# Altium project DigitalTransportAnalyser.PrjPcb
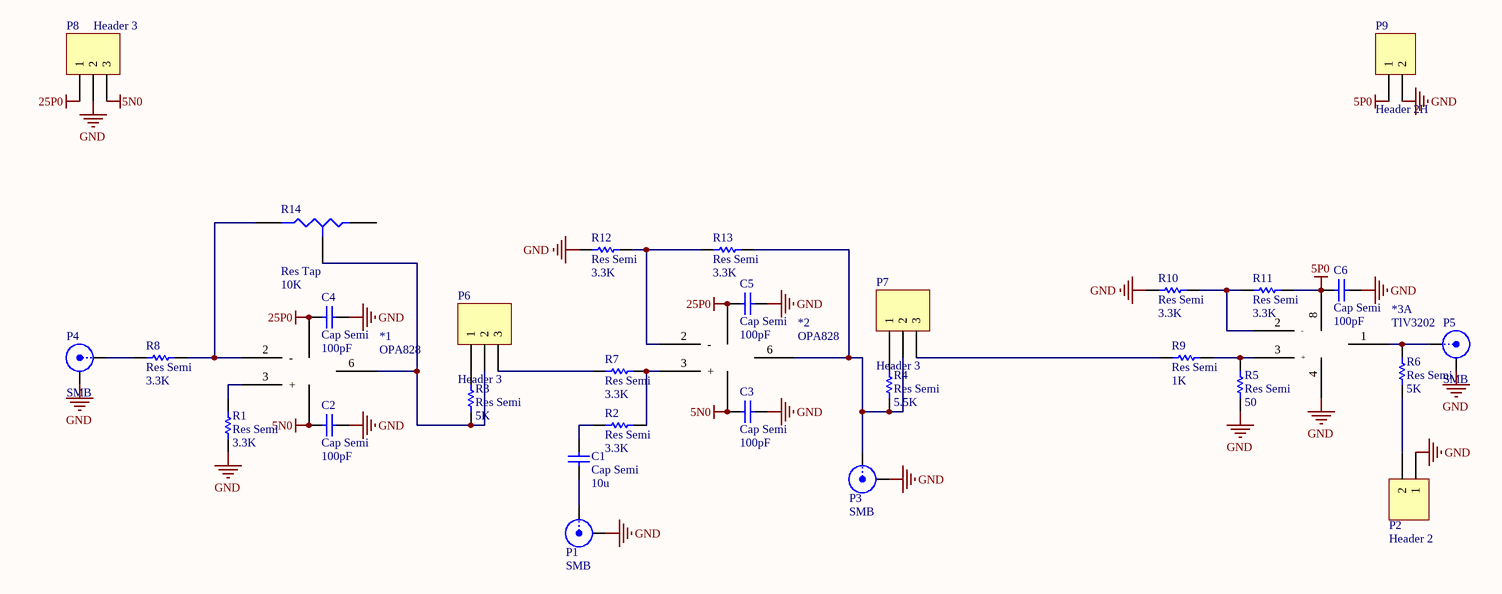
[diagram p0: Gain&Adder.SchDoc]
1 sheet, 32 parts. Net scope: global (net labels, ports and power ports of the same name join across sheets).
Board files: PCB1.PcbDoc, PCB2.PcbDoc, PCB3.PcbDoc

## Sheet Gain&Adder.SchDoc
size A3

### Parts
*1  OPA828  [SOIC_8]
*2  OPA828  [SOIC_8]
*3  TlV3202  [SOIC_8]  (part A of 2)
C1  Cap Semi  value 10u  [CAPC1608N]
C2  Cap Semi  value 100pF  [CAPC1608N]
C3  Cap Semi  value 100pF  [CAPC1608N]
C4  Cap Semi  value 100pF  [CAPC1608N]
C5  Cap Semi  value 100pF  [CAPC1608N]
C6  Cap Semi  value 100pF  [CAPC1608N]
P1  SMB  [SMB_V-RJ45]
P2  Header 2  [HDR1X2]
P3  SMB  [SMB_V-RJ45]
P4  SMB  [SMB_V-RJ45]
P5  SMB  [SMB_V-RJ45]
P6  Header 3  [HDR1X3]
P7  Header 3  [HDR1X3]
P8  Header 3  [HDR1X3]
P9  Header 2H  [HDR1X2]
R1  Res Semi  value 3.3K  [RESC1608N]
R2  Res Semi  value 3.3K  [RESC1608N]
R3  Res Semi  value 5K  [RESC1608N]
R4  Res Semi  value 5.5K  [RESC1608N]
R5  Res Semi  value 50  [RESC1608N]
R6  Res Semi  value 5K  [RESC1608N]
R7  Res Semi  value 3.3K  [RESC1608N]
R8  Res Semi  value 3.3K  [RESC1608N]
R9  Res Semi  value 1K  [RESC1608N]
R10  Res Semi  value 3.3K  [RESC1608N]
R11  Res Semi  value 3.3K  [RESC1608N]
R12  Res Semi  value 3.3K  [RESC1608N]
R13  Res Semi  value 3.3K  [RESC1608N]
R14  Res Tap  value 10K  [HDR1X3]

### Nets
5N0: *1.4(Vee) *2.4(Vee) C2.2 C3.1 P8.3
5P0: *3.8(VCC) C6.1 P9.1 R11.2
25P0: *1.7(Vcc) *2.7(Vcc) C4.2 C5.1 P8.1
GND: *3.4(GND) C2.1 C3.2 C4.1 C5.2 C6.2 P1.2(Y) P2.1 P3.2(Y) P4.2(Y) P5.2(Y) P8.2 P9.2 R1.1 R5.1 R10.1 R12.1
Net*1_2: *1.2(-) R8.2 R14.2(B)
Net*1_3: *1.3(+) R1.2
Net*1_6: *1.6(Out) P6.2 R3.1 R14.3(TAP)
Net*2_2: *2.2(-) R12.2 R13.1
Net*2_3: *2.3(+) R2.2 R7.2
Net*2_6: *2.6(Out) P3.1(X) P7.2 R4.1 R13.2
Net*3_1: *3.1(O1) P5.1(X) R6.2
Net*3_2: *3.2(-) R10.2 R11.1
Net*3_3: *3.3(+) R5.2 R9.2
NetC1_1: C1.1 P1.1(X)
NetC1_2: C1.2 R2.1
NetP2_2: P2.2 R6.1
NetP4_1: P4.1(X) R8.1
NetP6_1: P6.1 R3.2
NetP6_3: P6.3 R7.1
NetP7_1: P7.1 R4.2
NetP7_3: P7.3 R9.1

Not connected (* = marked no-connect by the designer): R14 1(A)

### Library data of the parts
C1-C6 = Cap Semi: Capacitor (Semiconductor SIM Model); Published: 8-Jun-2000; LatestRevisionDate: 29-May-2009; LatestRevisionNote: IPC-7351 Footprint Added.; PackageReference: C1206; Publisher: Altium Limited; PackageDescription: Chip Capacitor
P1 P3-P5 = SMB: SMB Straight Connector; LatestRevisionDate: 17-Jul-2002; LatestRevisionNote: Re-released for DXP Platform.; Publisher: Altium Limited
P2 = Header 2: Header, 2-Pin; LatestRevisionDate: 17-Jul-2002; LatestRevisionNote: Re-released for DXP Platform.; Publisher: Altium Limited
P6-P8 = Header 3: Header, 3-Pin; LatestRevisionDate: 17-Jul-2002; LatestRevisionNote: Re-released for DXP Platform.; Publisher: Altium Limited
P9 = Header 2H: Header, 2-Pin, Right Angle; LatestRevisionDate: 17-Jul-2002; LatestRevisionNote: Re-released for DXP Platform.; Publisher: Altium Limited
R1-R13 = Res Semi: Semiconductor Resistor; Published: 8-Jun-2000; LatestRevisionDate: 17-Jul-2002; LatestRevisionNote: Re-released for DXP Platform.; PackageReference: AXIAL-0.5; Publisher: Altium Limited; PackageDescription: Axial Device, Thru-Hole; 2 Leads; 0.5 in Pin Spacing
R14 = Res Tap: Tapped Resistor; pin to pad: 2>3 3>2; Sim Note: Enter the Resistance value and the set point into parameter fields.; Set Position: 0.5; Published: 24-Mar-1999; LatestRevisionDate: 17-Jul-2002; LatestRevisionNote: Re-released for DXP Platform.; PackageReference: VR3; Publisher: Altium Limited; PackageDescription: Variable Resistor, Thru-Hole; 3 Leads